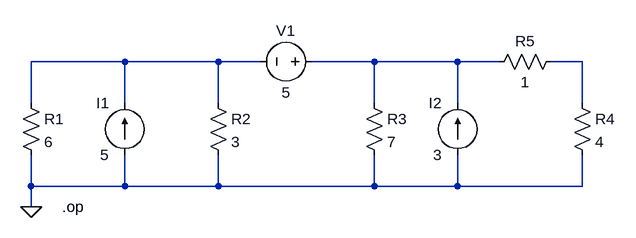
[diagram p0: schematic CH03-KP3-08.asc]
CH03-KP3-08.asc, the LTspice schematic file:
Version 4
SHEET 1 880 680
WIRE 64 240 -80 240
WIRE 208 240 64 240
WIRE 272 240 208 240
WIRE 448 240 352 240
WIRE 576 240 448 240
WIRE 640 240 576 240
WIRE 768 240 720 240
WIRE -80 304 -80 240
WIRE 64 304 64 240
WIRE 208 304 208 240
WIRE 448 304 448 240
WIRE 576 304 576 240
WIRE 768 304 768 240
WIRE -80 432 -80 384
WIRE 64 432 64 384
WIRE 64 432 -80 432
WIRE 208 432 208 384
WIRE 208 432 64 432
WIRE 448 432 448 384
WIRE 448 432 208 432
WIRE 576 432 576 384
WIRE 576 432 448 432
WIRE 768 432 768 384
WIRE 768 432 576 432
WIRE -80 464 -80 432
FLAG -80 464 0
SYMBOL res -96 288 R0
SYMATTR InstName R1
SYMATTR Value 6
SYMBOL res 192 288 R0
SYMATTR InstName R2
SYMATTR Value 3
SYMBOL res 432 288 R0
SYMATTR InstName R3
SYMATTR Value 7
SYMBOL res 752 288 R0
SYMATTR InstName R4
SYMATTR Value 4
SYMBOL res 736 224 R90
WINDOW 0 0 56 VBottom 2
WINDOW 3 32 56 VTop 2
SYMATTR InstName R5
SYMATTR Value 1
SYMBOL current 64 384 R180
WINDOW 0 24 80 Left 2
WINDOW 3 24 0 Left 2
SYMATTR InstName I1
SYMATTR Value 5
SYMBOL current 576 384 R180
WINDOW 0 24 80 Left 2
WINDOW 3 24 0 Left 2
SYMATTR InstName I2
SYMATTR Value 3
SYMBOL voltage 368 240 R90
WINDOW 0 -32 56 VBottom 2
WINDOW 3 32 56 VTop 2
SYMATTR InstName V1
SYMATTR Value 5
TEXT -32 464 Left 2 !.op

The netlist it stands for:
* CH03-KP3-08.asc
R1 N001 0 6
R2 N001 0 3
R3 N002 0 7
R4 N003 0 4
R5 N003 N002 1
I1 0 N001 5
I2 0 N002 3
V1 N002 N001 5
.op
.backanno
.end